# Altium schematic sheet SPI_IFC.SchDoc: =Project
size 420 x 297 mm; Author: G.Kasprowicz; CompanyName: WUT ISE; DrawnBy: G.Kasprowicz; Organization: WUT ISE; Address1: PW ISE; Address2: Nowowiejska 15/19 00-665 Warsaw; Address3: gkasprow@gmail.com; SheetNumber: 3; SheetTotal: 9; ModifiedBy: -; CheckedDate: -; Title2: SPI IFC; DivGrp: WUT ISE; Designer: G.Kasprowicz; SPICEModelCacheRYPVXPCY: <root> / <DocumentId>RYPVXPCY</DocumentId> / </root>; ModifiedDate: -; ProjectName: Sensor Box
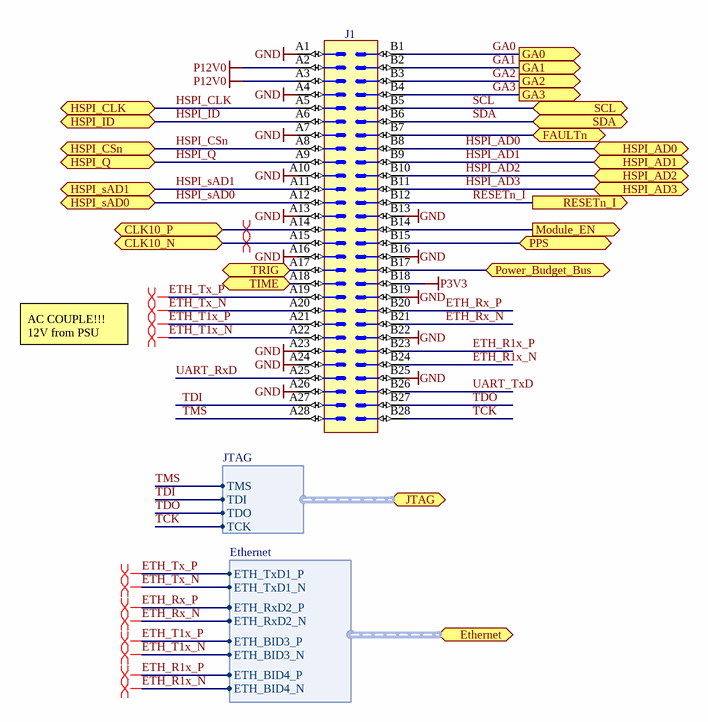
[diagram p0: SPI_IFC.SchDoc]

## Parts
J1  (no value)  [AMPHENOL_MINI-COOL-56P]

## Ports
CLK10_N (bidir), CLK10_P (bidir), Ethernet (bidir, harness Ethernet), FAULTn (bidir), GA0 (out), GA1 (out), GA2 (out), GA3 (out), HSPI_AD0 (bidir), HSPI_AD1 (bidir), HSPI_AD2 (bidir), HSPI_AD3 (bidir), HSPI_CLK (bidir), HSPI_CSn (bidir), HSPI_ID (bidir), HSPI_Q (bidir), HSPI_sAD0 (bidir), HSPI_sAD1 (bidir), JTAG (bidir, harness JTAG), Module_EN (out), Power_Budget_Bus (bidir), PPS (bidir), RESETn_I (out), SCL (bidir), SDA (bidir), TIME (bidir), TRIG (bidir)

## Harnesses
JTAG: TMS, TDI, TDO, TCK
Ethernet: ETH_TxD1_P, ETH_TxD1_N, ETH_RxD2_P, ETH_RxD2_N, ETH_BID3_P, ETH_BID3_N, ETH_BID4_P, ETH_BID4_N

## Nets
GND: J1.A1 J1.A4 J1.A7 J1.A10 J1.A13 J1.A16 J1.A23 J1.A24 J1.A26 J1.B13 J1.B16 J1.B19 J1.B22 J1.B25
P3V3: J1.B18
P12V0: J1.A2 J1.A3
CLK10_N: J1.A15 ; port CLK10_N
CLK10_P: J1.A14 ; port CLK10_P
ETH_R1x_N: J1.B24 ; port Ethernet.ETH_BID4_N
ETH_R1x_P: J1.B23 ; port Ethernet.ETH_BID4_P
ETH_Rx_N: J1.B21 ; port Ethernet.ETH_RxD2_N
ETH_Rx_P: J1.B20 ; port Ethernet.ETH_RxD2_P
ETH_T1x_N: J1.A22 ; port Ethernet.ETH_BID3_N
ETH_T1x_P: J1.A21 ; port Ethernet.ETH_BID3_P
ETH_Tx_N: J1.A20 ; port Ethernet.ETH_TxD1_N
ETH_Tx_P: J1.A19 ; port Ethernet.ETH_TxD1_P
FAULTn: J1.B7 ; port FAULTn
GA0: J1.B1 ; port GA0
GA1: J1.B2 ; port GA1
GA2: J1.B3 ; port GA2
GA3: J1.B4 ; port GA3
HSPI_AD0: J1.B8 ; port HSPI_AD0
HSPI_AD1: J1.B9 ; port HSPI_AD1
HSPI_AD2: J1.B10 ; port HSPI_AD2
HSPI_AD3: J1.B11 ; port HSPI_AD3
HSPI_CLK: J1.A5 ; port HSPI_CLK
HSPI_CSn: J1.A8 ; port HSPI_CSn
HSPI_ID: J1.A6 ; port HSPI_ID
HSPI_Q: J1.A9 ; port HSPI_Q
HSPI_sAD0: J1.A12 ; port HSPI_sAD0
HSPI_sAD1: J1.A11 ; port HSPI_sAD1
Module_EN: J1.B14 ; port Module_EN
Power_Budget_Bus: J1.B17 ; port Power_Budget_Bus
PPS: J1.B15 ; port PPS
RESETn_I: J1.B12 ; port RESETn_I
SCL: J1.B5 ; port SCL
SDA: J1.B6 ; port SDA
TCK: J1.B28 ; port JTAG.TCK
TDI: J1.A27 ; port JTAG.TDI
TDO: J1.B27 ; port JTAG.TDO
TIME: J1.A18 ; port TIME
TMS: J1.A28 ; port JTAG.TMS
TRIG: J1.A17 ; port TRIG
UART_RxD: J1.A25
UART_TxD: J1.B26

## Layout directives
differential pair: ETH_R1x_N, ETH_R1x_P, ETH_Rx_N, ETH_Rx_P, ETH_T1x_N, ETH_T1x_P, ETH_Tx_N, ETH_Tx_P
differential pair; net class D100: CLK10_N, CLK10_P

## Notes on the sheet
- AC COUPLE!!!
  12V from PSU
- Project/Equipment
- Document
- Designer
- Drawn by
- Check.by
- Copyright WUT ISE 2018.
  This documentation describes Open Hardware and is licensed under the CERN OHL v.1.1. You may redistribute and modify this documentation under the terms of the CERN OHL v.1.1. (http://ohwr.org/CERNOHL). This documentation is distributed WITHOUT ANY EXPRESS OR IMPLIED WARRANTY, INCLUDING OF MERCHANTABILITY, SATISFACTORY QUALITY AND FITNESS FOR A PARTICULAR PURPOSE. Please see the CERN OHL v.1.1 for applicable conditions.
- Contact
- File
- Last Mod.
- Print Date
- Sheet
- Size
- A3
- of
- Rev

## Library data of the parts
J1 = AMPHENOL_MINI-Cool-56P: 64 contacts Board Eddge PCI Express x4 Socket; Part Description: PCB Mini Cool Edge 0.60mm,Storage and Server connector ,Gen Z, 56 signal pins, SMT; PressFit: No; Part Number: AMPHENOL_MINI-Cool-56P; Component Kind: Standard (No BOM); Component Type: Standard (No BOM); Pin Count: 56; Mounted: Yes; Socket: No; SMD: Yes; Sense: No; Status: None; Manufacturer: AMPHENOL; Manufacturer Part Number: AMPHENOL_MINI-Cool-56P; ComponentHeight: 0mm; HelpURL: \\cern.ch\dfs\Applications\Altium\Datasheets\AMPHENOL_ME1005610101011.pdf; Author: CERN DEM HF; CreateDate: 05.01.2026; LatestRevisionDate: 05.01.2026